# Altium schematic sheet EthernetPHY.SchDoc
size A4
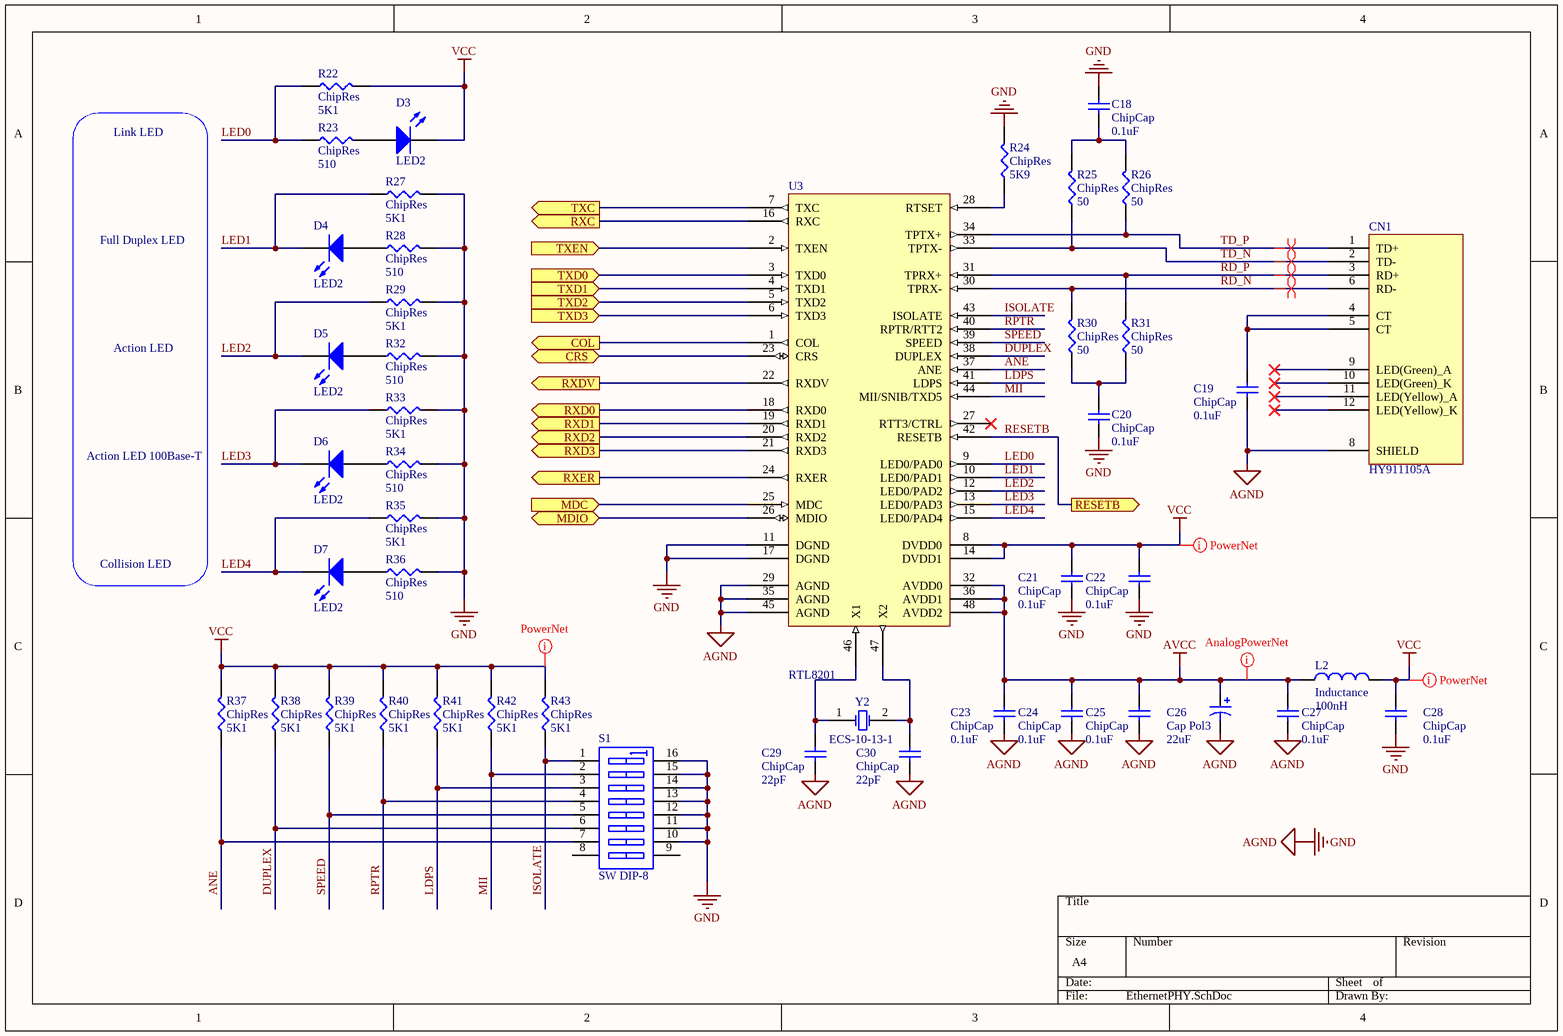
[diagram p0: EthernetPHY.SchDoc]

## Parts
C18  ChipCap  value 0.1uF  [CAP0805]
C19  ChipCap  value 0.1uF  [CAP0805]
C20  ChipCap  value 0.1uF  [CAP0805]
C21  ChipCap  value 0.1uF  [CAP0805]
C22  ChipCap  value 0.1uF  [CAP0805]
C23  ChipCap  value 0.1uF  [CAP0805]
C24  ChipCap  value 0.1uF  [CAP0805]
C25  ChipCap  value 0.1uF  [CAP0805]
C26  Cap Pol3  value 22uF  [1812]
C27  ChipCap  value 0.1uF  [CAP0805]
C28  ChipCap  value 0.1uF  [CAP0805]
C29  ChipCap  value 22pF  [CAP0805]
C30  ChipCap  value 22pF  [CAP0805]
CN1  HY911105A  [HR911105A]
D3  LED2  [3.2X1.6X1.1]
D4  LED2  [3.2X1.6X1.1]
D5  LED2  [3.2X1.6X1.1]
D6  LED2  [3.2X1.6X1.1]
D7  LED2  [3.2X1.6X1.1]
L2  Inductance  value 100nH  [CM32]
R22  ChipRes  value 5K1  [RES0805]
R23  ChipRes  value 510  [RES0805]
R24  ChipRes  value 5K9  [RES0805]
R25  ChipRes  value 50  [RES0805]
R26  ChipRes  value 50  [RES0805]
R27  ChipRes  value 5K1  [RES0805]
R28  ChipRes  value 510  [RES0805]
R29  ChipRes  value 5K1  [RES0805]
R30  ChipRes  value 50  [RES0805]
R31  ChipRes  value 50  [RES0805]
R32  ChipRes  value 510  [RES0805]
R33  ChipRes  value 5K1  [RES0805]
R34  ChipRes  value 510  [RES0805]
R35  ChipRes  value 5K1  [RES0805]
R36  ChipRes  value 510  [RES0805]
R37  ChipRes  value 5K1  [RES0805]
R38  ChipRes  value 5K1  [RES0805]
R39  ChipRes  value 5K1  [RES0805]
R40  ChipRes  value 5K1  [RES0805]
R41  ChipRes  value 5K1  [RES0805]
R42  ChipRes  value 5K1  [RES0805]
R43  ChipRes  value 5K1  [RES0805]
S1  SW DIP-8  [DIP_SW_8WAY_SMD]
U3  RTL8201  [LQFP48 SOT313-2]
Y2  ECS-10-13-1  [HC-49U]

## Ports
COL (out), CRS (bidir), MDC (in), MDIO (bidir), RESETB (out), RXC (out), RXD0 (out), RXD1 (out), RXD2 (out), RXD3 (out), RXDV (out), RXER (out), TXC (out), TXD0 (in), TXD1 (in), TXD2 (in), TXD3 (in), TXEN (in)

## Nets
AGND: C18.2 C19.1 C20.1 C21.1 C22.1 C23.1 C24.1 C25.1 C26.2 C27.1 C28.1 C29.1 C30.1 CN1.8(SHIELD) R24.2 R27.2 R28.2 R29.2 R32.2 R33.2 R34.2 R35.2 R36.2 S1.10(B7) S1.11(B6) S1.12(B5) S1.13(B4) S1.14(B3) S1.15(B2) S1.16(B1) U3.11(DGND) U3.17(DGND) U3.29(AGND) U3.35(AGND) U3.45(AGND)  [also labelled GND]
AVCC: C23.2 C24.2 C25.2 C26.1 C27.2 L2.2 U3.32(AVDD0) U3.36(AVDD1) U3.48(AVDD2)
VCC: C21.2 C22.2 C28.2 D3.2(K) L2.1 R22.2 R37.2 R38.2 R39.2 R40.2 R41.2 R42.2 R43.2 U3.8(DVDD0) U3.14(DVDD1)
ANE: R37.1 S1.7(A7) U3.37(ANE)
COL: U3.1(COL) ; port COL
CRS: U3.23(CRS) ; port CRS
DUPLEX: R38.1 S1.6(A6) U3.38(DUPLEX)
ISOLATE: R43.1 S1.1(A1) U3.43(ISOLATE)
LDPS: R41.1 S1.3(A3) U3.41(LDPS)
LED0: R22.1 R23.1 U3.9(LED0/PAD0)
LED1: D4.2(K) R27.1 U3.10(LED0/PAD1)
LED2: D5.2(K) R29.1 U3.12(LED0/PAD2)
LED3: D6.2(K) R33.1 U3.13(LED0/PAD3)
LED4: D7.2(K) R35.1 U3.15(LED0/PAD4)
MDC: U3.25(MDC) ; port MDC
MDIO: U3.26(MDIO) ; port MDIO
MII: R42.1 S1.2(A2) U3.44(MII/SNIB/TXD5)
RD_N: CN1.6(RD-) R30.2 U3.30(TPRX-)
RD_P: CN1.3(RD+) R31.2 U3.31(TPRX+)
RESETB: U3.42(RESETB) ; port RESETB
RPTR: R40.1 S1.4(A4) U3.40(RPTR/RTT2)
RXC: U3.16(RXC) ; port RXC
RXD0: U3.18(RXD0) ; port RXD0
RXD1: U3.19(RXD1) ; port RXD1
RXD2: U3.20(RXD2) ; port RXD2
RXD3: U3.21(RXD3) ; port RXD3
RXDV: U3.22(RXDV) ; port RXDV
RXER: U3.24(RXER) ; port RXER
SPEED: R39.1 S1.5(A5) U3.39(SPEED)
TD_N: CN1.2(TD-) R25.1 U3.33(TPTX-)
TD_P: CN1.1(TD+) R26.1 U3.34(TPTX+)
TXC: U3.7(TXC) ; port TXC
TXD0: U3.3(TXD0) ; port TXD0
TXD1: U3.4(TXD1) ; port TXD1
TXD2: U3.5(TXD2) ; port TXD2
TXD3: U3.6(TXD3) ; port TXD3
TXEN: U3.2(TXEN) ; port TXEN
NetC18_1: C18.1 R25.2 R26.2
NetC19_2: C19.2 CN1.4(CT) CN1.5(CT)
NetC20_2: C20.2 R30.1 R31.1
NetC29_2: C29.2 U3.46(X1) Y2.1(OSC1)
NetC30_2: C30.2 U3.47(X2) Y2.2(OSC2)
NetD3_1: D3.1(A) R23.2
NetD4_1: D4.1(A) R28.1
NetD5_1: D5.1(A) R32.1
NetD6_1: D6.1(A) R34.1
NetD7_1: D7.1(A) R36.1
NetR24_1: R24.1 U3.28(RTSET)

Not connected (* = marked no-connect by the designer): CN1 9(LED(Green)_A)* 10(LED(Green)_K)* 11(LED(Yellow)_A)* 12(LED(Yellow)_K)*; S1 8(A8) 9(B8); U3 27(RTT3/CTRL)*

## Layout directives
differential pair: RD_N, RD_P, TD_N, TD_P
net class Undefined: AVCC, VCC

## Notes on the sheet
- Link LED
- Full Duplex LED
- Action LED
- Action LED 100Base-T
- Collision LED

## Library data of the parts
C18-C25 C27-C30 = ChipCap: Capacitor; Published: 8-Jun-2000; LatestRevisionDate: 17-Jul-2002; LatestRevisionNote: Re-released for DXP Platform.; PackageReference: RAD-0.3; Publisher: Altium Limited
C26 = Cap Pol3: Polarized Capacitor (Surface Mount); Published: 8-Jun-2000; LatestRevisionDate: 29-May-2009; LatestRevisionNote: IPC-7351 Footprint Added.; PackageReference: C0805; Publisher: Altium Limited; PackageDescription: Chip Capacitor
D3-D7 = LED2: Typical RED, GREEN, YELLOW, AMBER GaAs LED; Published: 8-Jun-2000; LatestRevisionDate: 17-Jul-2002; LatestRevisionNote: Re-released for DXP Platform.; PackageVersion: Feb-2002; PackageReference: 3.2X1.6X1.1; Publisher: Altium Limited; PackageDescription: SM LED; 2 Flat Leads
L2 = ChipInductance
R22-R43 = ChipRes: Chip resistor
S1 = SW DIP-8: DIP Switch, 8 Position, SPST; Published: 24-Mar-1999; LatestRevisionDate: 17-Jul-2002; LatestRevisionNote: Re-released for DXP Platform.; PackageReference: DIP_SW_8WAY_SMD; Publisher: Altium Limited
Y2 = ECS-10-13-1: Crystal Oscillator; Published: 17-Jul-2002; DatasheetDocument: 18-Apr-2000; PackageReference: HC-49U; Publisher: Altium Limited; ComponentLink1Description: Manufacturer Link; ComponentLink1URL: http://www.ecsxtal.com/; ComponentLink2Description: Datasheet; ComponentLink2URL: http://www.ecsxtal.com/pdf2/HC49U.PDF